# EAGLE schematic PotDiv1 v4 (EAGLE 9.7.0)
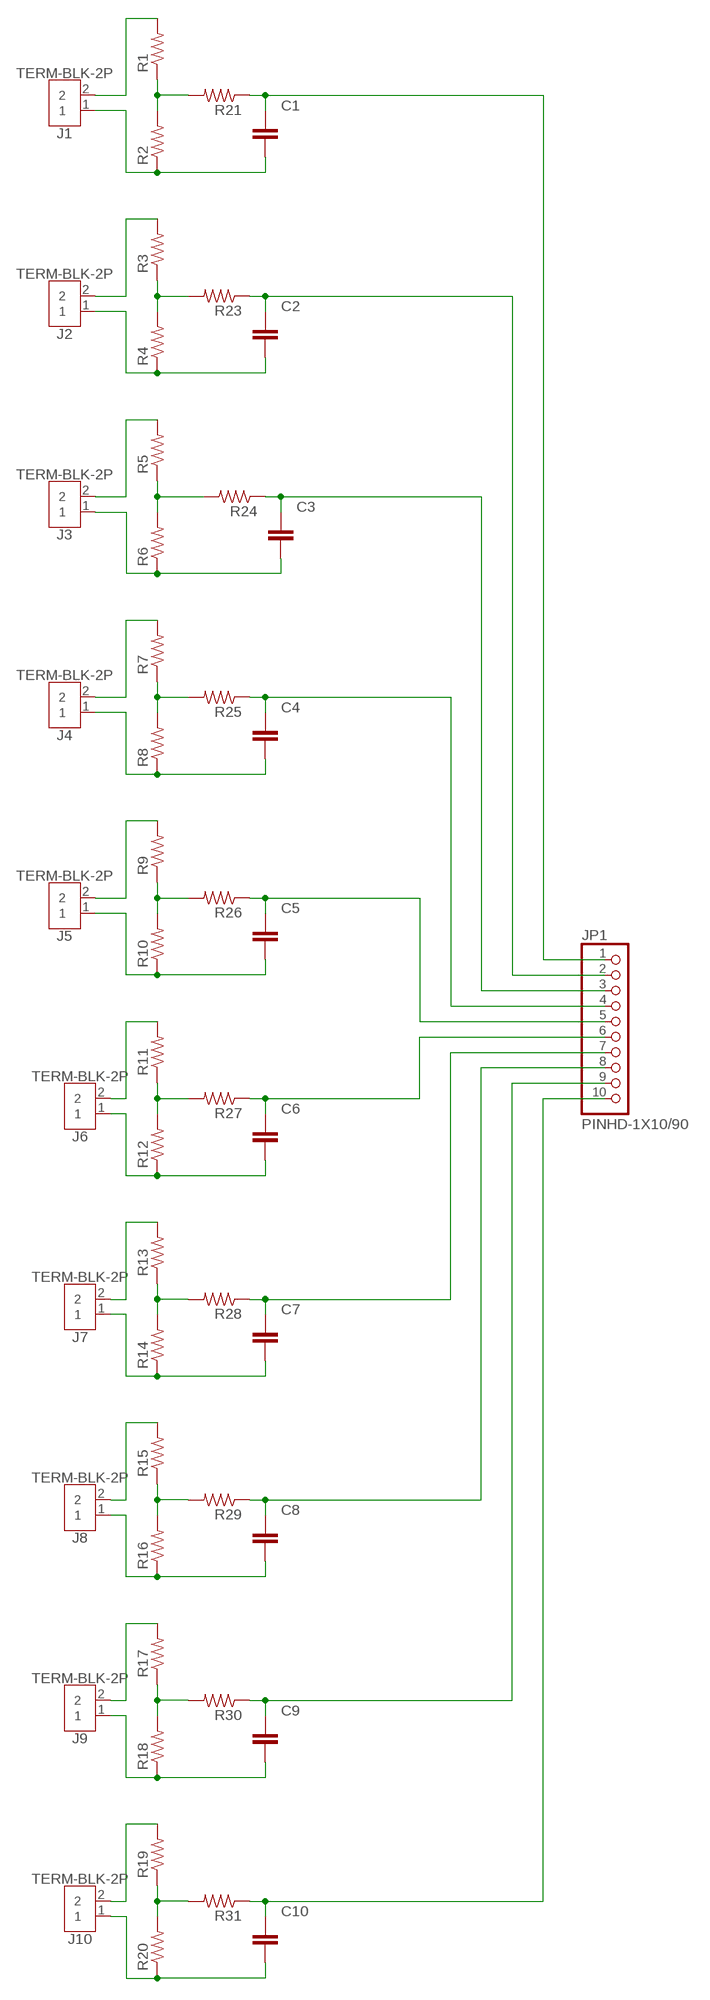
[diagram p0: schematic, sheet 1]

## Parts
C1  C_RADIAL-12.5MM-DIA  [CAPRD550W60D1025H1250B]
C2  C_RADIAL-12.5MM-DIA  [CAPRD550W60D1025H1250B]
C3  C_RADIAL-12.5MM-DIA  [CAPRD550W60D1025H1250B]
C4  C_RADIAL-12.5MM-DIA  [CAPRD550W60D1025H1250B]
C5  C_RADIAL-12.5MM-DIA  [CAPRD550W60D1025H1250B]
C6  C_RADIAL-12.5MM-DIA  [CAPRD550W60D1025H1250B]
C7  C_RADIAL-12.5MM-DIA  [CAPRD550W60D1025H1250B]
C8  C_RADIAL-12.5MM-DIA  [CAPRD550W60D1025H1250B]
C9  C_RADIAL-12.5MM-DIA  [CAPRD550W60D1025H1250B]
C10  C_RADIAL-12.5MM-DIA  [CAPRD550W60D1025H1250B]
J1  TERM-BLK-2P  2828XX-2282837-2  [TERMBLK_508-2N]
J2  TERM-BLK-2P  2828XX-2282837-2  [TERMBLK_508-2N]
J3  TERM-BLK-2P  2828XX-2282837-2  [TERMBLK_508-2N]
J4  TERM-BLK-2P  2828XX-2282837-2  [TERMBLK_508-2N]
J5  TERM-BLK-2P  2828XX-2282837-2  [TERMBLK_508-2N]
J6  TERM-BLK-2P  2828XX-2282837-2  [TERMBLK_508-2N]
J7  TERM-BLK-2P  2828XX-2282837-2  [TERMBLK_508-2N]
J8  TERM-BLK-2P  2828XX-2282837-2  [TERMBLK_508-2N]
J9  TERM-BLK-2P  2828XX-2282837-2  [TERMBLK_508-2N]
J10  TERM-BLK-2P  2828XX-2282837-2  [TERMBLK_508-2N]
JP1  PINHD-1X10/90  [1X10/90]
R1  R-US_AXIAL-7.2MM-PITCH  [RESAD724W46L381D178B]
R2  R-US_AXIAL-7.2MM-PITCH  [RESAD724W46L381D178B]
R3  R-US_AXIAL-7.2MM-PITCH  [RESAD724W46L381D178B]
R4  R-US_AXIAL-7.2MM-PITCH  [RESAD724W46L381D178B]
R5  R-US_AXIAL-7.2MM-PITCH  [RESAD724W46L381D178B]
R6  R-US_AXIAL-7.2MM-PITCH  [RESAD724W46L381D178B]
R7  R-US_AXIAL-7.2MM-PITCH  [RESAD724W46L381D178B]
R8  R-US_AXIAL-7.2MM-PITCH  [RESAD724W46L381D178B]
R9  R-US_AXIAL-7.2MM-PITCH  [RESAD724W46L381D178B]
R10  R-US_AXIAL-7.2MM-PITCH  [RESAD724W46L381D178B]
R11  R-US_AXIAL-7.2MM-PITCH  [RESAD724W46L381D178B]
R12  R-US_AXIAL-7.2MM-PITCH  [RESAD724W46L381D178B]
R13  R-US_AXIAL-7.2MM-PITCH  [RESAD724W46L381D178B]
R14  R-US_AXIAL-7.2MM-PITCH  [RESAD724W46L381D178B]
R15  R-US_AXIAL-7.2MM-PITCH  [RESAD724W46L381D178B]
R16  R-US_AXIAL-7.2MM-PITCH  [RESAD724W46L381D178B]
R17  R-US_AXIAL-7.2MM-PITCH  [RESAD724W46L381D178B]
R18  R-US_AXIAL-7.2MM-PITCH  [RESAD724W46L381D178B]
R19  R-US_AXIAL-7.2MM-PITCH  [RESAD724W46L381D178B]
R20  R-US_AXIAL-7.2MM-PITCH  [RESAD724W46L381D178B]
R21  R-US_AXIAL-7.2MM-PITCH  [RESAD724W46L381D178B]
R23  R-US_AXIAL-7.2MM-PITCH  [RESAD724W46L381D178B]
R24  R-US_AXIAL-7.2MM-PITCH  [RESAD724W46L381D178B]
R25  R-US_AXIAL-7.2MM-PITCH  [RESAD724W46L381D178B]
R26  R-US_AXIAL-7.2MM-PITCH  [RESAD724W46L381D178B]
R27  R-US_AXIAL-7.2MM-PITCH  [RESAD724W46L381D178B]
R28  R-US_AXIAL-7.2MM-PITCH  [RESAD724W46L381D178B]
R29  R-US_AXIAL-7.2MM-PITCH  [RESAD724W46L381D178B]
R30  R-US_AXIAL-7.2MM-PITCH  [RESAD724W46L381D178B]
R31  R-US_AXIAL-7.2MM-PITCH  [RESAD724W46L381D178B]

## Nets
N$1: J1.2 R1.2
N$2: R1.1 R2.2 R21.2
N$3: C1.2 J1.1 R2.1
N$4: C1.1 JP1.1 R21.1
N$5: J2.2 R3.2
N$6: R3.1 R4.2 R23.2
N$7: C2.2 J2.1 R4.1
N$8: C2.1 JP1.2 R23.1
N$9: J3.2 R5.2
N$10: R5.1 R6.2 R24.2
N$11: C3.1 JP1.3 R24.1
N$12: C3.2 J3.1 R6.1
N$13: J4.2 R7.2
N$14: R7.1 R8.2 R25.2
N$15: C4.1 JP1.4 R25.1
N$16: C4.2 J4.1 R8.1
N$17: J5.2 R9.2
N$18: R9.1 R10.2 R26.2
N$19: C5.2 J5.1 R10.1
N$20: C5.1 JP1.5 R26.1
N$21: J6.2 R11.2
N$22: R11.1 R12.2 R27.2
N$23: C6.1 JP1.6 R27.1
N$24: C6.2 J6.1 R12.1
N$25: J7.2 R13.2
N$26: R13.1 R14.2 R28.2
N$27: C7.1 JP1.7 R28.1
N$28: C7.2 J7.1 R14.1
N$29: J8.2 R15.2
N$30: R15.1 R16.2 R29.2
N$31: C8.1 JP1.8 R29.1
N$32: C8.2 J8.1 R16.1
N$33: J9.2 R17.2
N$34: R17.1 R18.2 R30.2
N$35: C9.1 JP1.9 R30.1
N$36: C9.2 J9.1 R18.1
N$37: J10.2 R19.2
N$38: C10.2 J10.1 R20.1
N$39: R19.1 R20.2 R31.2
N$40: C10.1 JP1.10 R31.1

## Library data of the parts
C1-C10 = Tutorial - Fusion 360:C: Capacitor - Generic; CATEGORY: Capacitor
J1-J10 = Connector:2828XX-2: 2 Position Wire to Board Terminal Block Horizontal with Board Datasheet <https://www.te.com.cn/commerce/DocumentDelivery/DDEController?Action=showdoc&DocId=Catalog+Section%7F1308389_EUROSTYLE_TERMINAL_BLOCKS%7F0607%7Fpdf%7FEnglish%7FENG_CS_1308389_EUROSTYLE_TERMINAL_BLOCKS_0607.pdf%7F2-282837-5>; CATEGORY: Fixed Terminal Blocks; DESCRIPTION: Fixed Terminal Blocks 5.08MM PCB MOUNT 2P; MANUFACTURER: TE Connectivity AMP Connectors; MPN: 282837-2; OPERATING_TEMPERATURE: -40°C to +105°C; PART_STATUS: ACTIVE; PITCH: 0.200" (5.08mm); ROHS_COMPLIANCE: RoHS Compliant; SERIES: Buchanan; SUBCATEGORY: Terminal Blocks; TYPE: Through Hole; Screw - Rising Cage Clamp; Side wire entry, Horizontal with Board
JP1 = Connector:PINHD-1X10: PIN HEADER; CATEGORY: Headers; DESCRIPTION: Header, Right Angle, 10 Position; MANUFACTURER: Generic; MPN: Generic; OPERATING_TEMPERATURE: Generic; PART_STATUS: Active; PITCH: 0.100" (2.54mm); ROHS_COMPLIANCE: Generic; SERIES: Generic; SUB-CATEGORY: Headers, Male Pins; TYPE: Board to Board or Cable, Unshrouded, Through Hole, Right Angle
R1-R21 R23-R31 = Tutorial - Fusion 360:R-US: Resistor Fixed - ANSI; CATEGORY: Resistor; SUB-CATEGORY: Fixed